# EAGLE schematic kwpa_ldmos2 (EAGLE 7.7.0)

## Sheet 1 of 2: Input
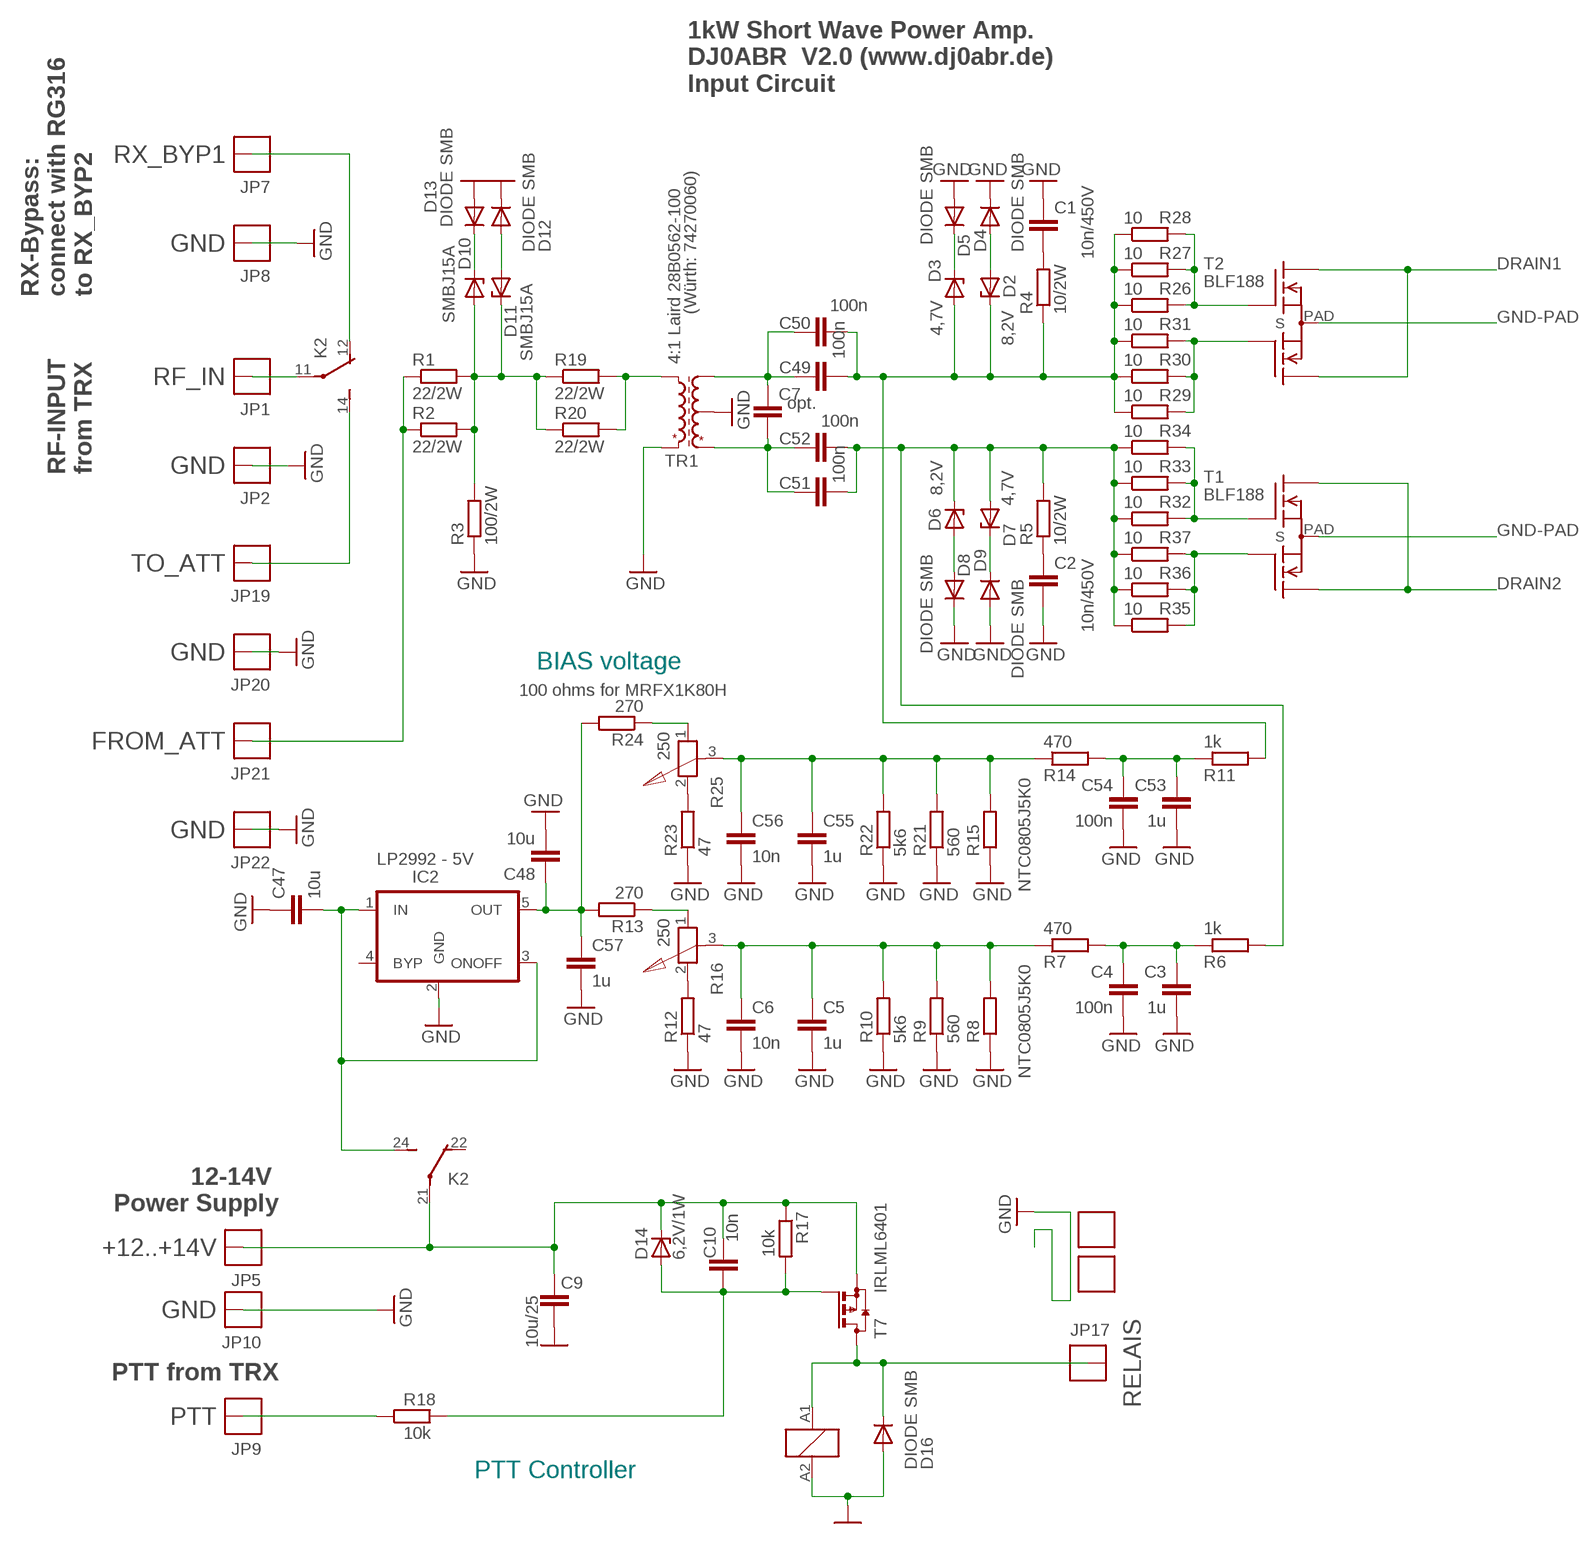
[diagram p0: schematic, sheet 1]

### Parts
C1  10n/450V  C-EUC1206K  [C1206K]
C2  10n/450V  C-EUC1206K  [C1206K]
C3  1u  C-EUC0603K  [C0603K]
C4  100n  C-EUC0603K  [C0603K]
C5  1u  C-EUC0603K  [C0603K]
C6  10n  C-EUC0603K  [C0603K]
C7  opt.  C-EUC1206K  [C1206K]
C9  10u/25  C-EUC0805K  [C0805K]
C10  10n  C-EUC0603K  [C0603K]
C47  10u  C-EUC0805K  [C0805K]
C48  10u  C-EUC0603K  [C0603K]
C49  100n  C-EUC1812K  [C1812K]
C50  100n  C-EUC1812K  [C1812K]
C51  100n  C-EUC1812K  [C1812K]
C52  100n  C-EUC1812K  [C1812K]
C53  1u  C-EUC0603K  [C0603K]
C54  100n  C-EUC0603K  [C0603K]
C55  1u  C-EUC0603K  [C0603K]
C56  10n  C-EUC0603K  [C0603K]
C57  1u  C-EUC0603K  [C0603K]
D2  8,2V  ZPYSMA  [SMA]
D3  4,7V  ZPYSMA  [SMA]
D4  DIODE SMB  DIODE-SMB  [SMB]
D5  DIODE SMB  DIODE-SMB  [SMB]
D6  8,2V  ZPYSMA  [SMA]
D7  4,7V  ZPYSMA  [SMA]
D8  DIODE SMB  DIODE-SMB  [SMB]
D9  DIODE SMB  DIODE-SMB  [SMB]
D10  SMBJ15A  ZPYSMA  [SMA]
D11  SMBJ15A  ZPYSMA  [SMA]
D12  DIODE SMB  DIODE-SMB  [SMB]
D13  DIODE SMB  DIODE-SMB  [SMB]
D14  6,2V/1W  ZPYSMA  [SMA]
D16  DIODE SMB  DIODE-SMB  [SMB]
FID1  FIDUCIAL  [FIDUCIAL]
FID2  FIDUCIAL  [FIDUCIAL]
H1  HOLE_32  [HOLE32]
H2  HOLE_32  [HOLE32]
H3  HOLE_32  [HOLE32]
H4  HOLE_32  [HOLE32]
H5  HOLE_32  [HOLE32]
H6  HOLE_32  [HOLE32]
H7  HOLE_32  [HOLE32]
H8  HOLE_32  [HOLE32]
H9  HOLE_32  [HOLE32]
H10  HOLE_32  [HOLE32]
H11  HOLE_32  [HOLE32]
H12  HOLE_32  [HOLE32]
H13  HOLE_32  [HOLE32]
H14  HOLE_32  [HOLE32]
IC2  LP2992 - 5V  UREG5  [SOT23-5]
JP1  RF_IN  THICKPINSQUARE  [THICKPIN]
JP2  GND  THICKPINSQUARE  [THICKPIN]
JP5  +12..+14V  THICKPINSQUARE  [THICKPIN]
JP7  RX_BYP1  THICKPINSQUARE  [THICKPIN]
JP8  GND  THICKPINSQUARE  [THICKPIN]
JP9  PTT  THICKPINSQUARE  [THICKPIN]
JP10  GND  THICKPINSQUARE  [THICKPIN]
JP17  RELAIS  THICKPINSQUARE  [THICKPIN]
JP19  TO_ATT  THICKPINSQUARE  [THICKPIN]
JP20  GND  THICKPINSQUARE  [THICKPIN]
JP21  FROM_ATT  THICKPINSQUARE  [THICKPIN]
JP22  GND  THICKPINSQUARE  [THICKPIN]
K2  FINDER-30.22  [FINDER-30.22]
R1  22/2W  R-EU_R2512  [R2512]
R2  22/2W  R-EU_R2512  [R2512]
R3  100/2W  R-EU_R2512  [R2512]
R4  10/2W  R-EU_R2512  [R2512]
R5  10/2W  R-EU_R2512  [R2512]
R6  1k  R-EU_R0603  [R0603]
R7  470  R-EU_R0603  [R0603]
R8  NTC0805J5K0  R-EU_R0805  [R0805]
R9  560  R-EU_R0603  [R0603]
R10  5k6  R-EU_R0603  [R0603]
R11  1k  R-EU_R0603  [R0603]
R12  47  R-EU_R0603  [R0603]
R13  270  R-EU_R0603  [R0603]
R14  470  R-EU_R0603  [R0603]
R15  NTC0805J5K0  R-EU_R0805  [R0805]
R16  250  MINIPOTI-S  [MINIPOTI]
R17  10k  R-EU_R0603  [R0603]
R18  10k  R-EU_R0603  [R0603]
R19  22/2W  R-EU_R2512  [R2512]
R20  22/2W  R-EU_R2512  [R2512]
R21  560  R-EU_R0603  [R0603]
R22  5k6  R-EU_R0603  [R0603]
R23  47  R-EU_R0603  [R0603]
R24  270  R-EU_R0603  [R0603]
R25  250  MINIPOTI-S  [MINIPOTI]
R26  10  R-EU_R1206  [R1206]
R27  10  R-EU_R1206  [R1206]
R28  10  R-EU_R1206  [R1206]
R29  10  R-EU_R1206  [R1206]
R30  10  R-EU_R1206  [R1206]
R31  10  R-EU_R1206  [R1206]
R32  10  R-EU_R1206  [R1206]
R33  10  R-EU_R1206  [R1206]
R34  10  R-EU_R1206  [R1206]
R35  10  R-EU_R1206  [R1206]
R36  10  R-EU_R1206  [R1206]
R37  10  R-EU_R1206  [R1206]
T1  BLF188  [BLF188]
T2  BLF188  [BLF188]
T7  IRLML6401  BSS84  [SOT23]
TR1  4:1 Laird 28B0562-100  TRAFO_1W_2W_MIT_ANZAPFUNGKWPAINPUT  [KW-INPUT_LAIRD_28B0562-100]

### Nets
ATTM: D10.A D11.C R1.2 R2.2 R3.2 R19.1 R20.1
BYP1: JP7.1 K2.12(-1:O)
DD1: C49.2 C50.2 D2.C D3.A R4.1 R11.2 R26.1 R27.1 R28.1 R29.1 R30.1 R31.1
DD2: C51.2 C52.2 D6.C D7.A R5.2 R6.2 R32.1 R33.1 R34.1 R35.1 R36.1 R37.1
DI1: C7.1 C49.1 C50.1 TR1.OUT2(S2)
DI2: C7.2 C51.1 C52.1 TR1.OUT1(S1)
DRAIN1: T2.1(D1) T2.2(D2) ; also sheet 2
DRAIN2: T1.1(D1) T1.2(D2) ; also sheet 2
G1: R26.2 R27.2 R28.2 T2.3(G1)
G2: R29.2 R30.2 R31.2 T2.4(G2)
G3: R32.2 R33.2 R34.2 T1.3(G1)
G4: R35.2 R36.2 R37.2 T1.4(G2)
GND: C1.1 C2.2 C3.2 C4.2 C5.2 C6.2 C9.2 C47.1 C48.2 C53.2 C54.2 C55.2 C56.2 C57.2 D4.C D5.A D8.C D9.A D12.C D13.A D16.A H1.P$1 H2.P$1 H3.P$1 H4.P$1 H5.P$1 H6.P$1 H7.P$1 H8.P$1 H9.P$1 H10.P$1 H11.P$1 H12.P$1 H13.P$1 H14.P$1 IC2.2(GND) JP2.1 JP8.1 JP10.1 JP20.1 JP22.1 K2.A2 R3.1 R8.1 R9.1 R10.1 R12.1 R15.1 R21.1 R22.1 R23.1 TR1.COM(SM) TR1.GND(P1) ; supply symbol labelled  ; also sheet 2
N$1: JP21.1 R1.1 R2.1
N$2: C47.2 IC2.1(IN) IC2.3(ONOFF) K2.24(-2:S)
N$3: D10.C D13.C
N$5: C1.2 R4.2
N$6: C2.1 R5.1
N$7: JP19.1 K2.14(-1:S)
N$8: C3.1 C4.1 R6.1 R7.2
N$9: C5.1 C6.1 R7.1 R8.2 R9.2 R10.2 R16.3
N$10: T1.PAD(S)
N$12: R12.2 R16.2
N$13: R13.1 R16.1
N$14: C48.1 C57.1 IC2.5(OUT) R13.2 R24.2
N$15: D3.C D5.C
N$16: D2.A D4.A
N$17: C53.1 C54.1 R11.1 R14.2
N$18: D7.C D9.C
N$19: D6.A D8.A
N$20: D11.A D12.A
N$21: C55.1 C56.1 R14.1 R15.2 R21.2 R22.2 R25.3
N$22: R23.2 R25.2
N$23: R24.1 R25.1
N$26: T2.PAD(S)
N$28: C10.2 D14.A R17.2 R18.2 T7.1(G)
N$33: JP9.1 R18.1
N$34: R19.2 R20.2 TR1.IN(P2)
RELAISOUT: D16.C JP17.1 K2.A1 T7.3(D)
RFIN: JP1.1 K2.11(-1:P)
U12: C9.1 C10.1 D14.C JP5.1 K2.21(-2:P) R17.1 T7.2(S)
Unconnected: FID1.P$1 FID2.P$1 K2.22(-2:O)

### Notes on the sheet
- 1kW Short Wave Power Amp.
  DJ0ABR  V2.0 (www.dj0abr.de)
  Input Circuit
- RX-Bypass:
  connect with RG316
  to RX_BYP2
- (Würth: 74270060)
- GND-PAD
- RF-INPUT
  from TRX
- GND-PAD
- BIAS voltage
- 100 ohms for MRFX1K80H
- 12-14V 
  Power Supply
- PTT from TRX
- PTT Controller

## Sheet 2 of 2: Output
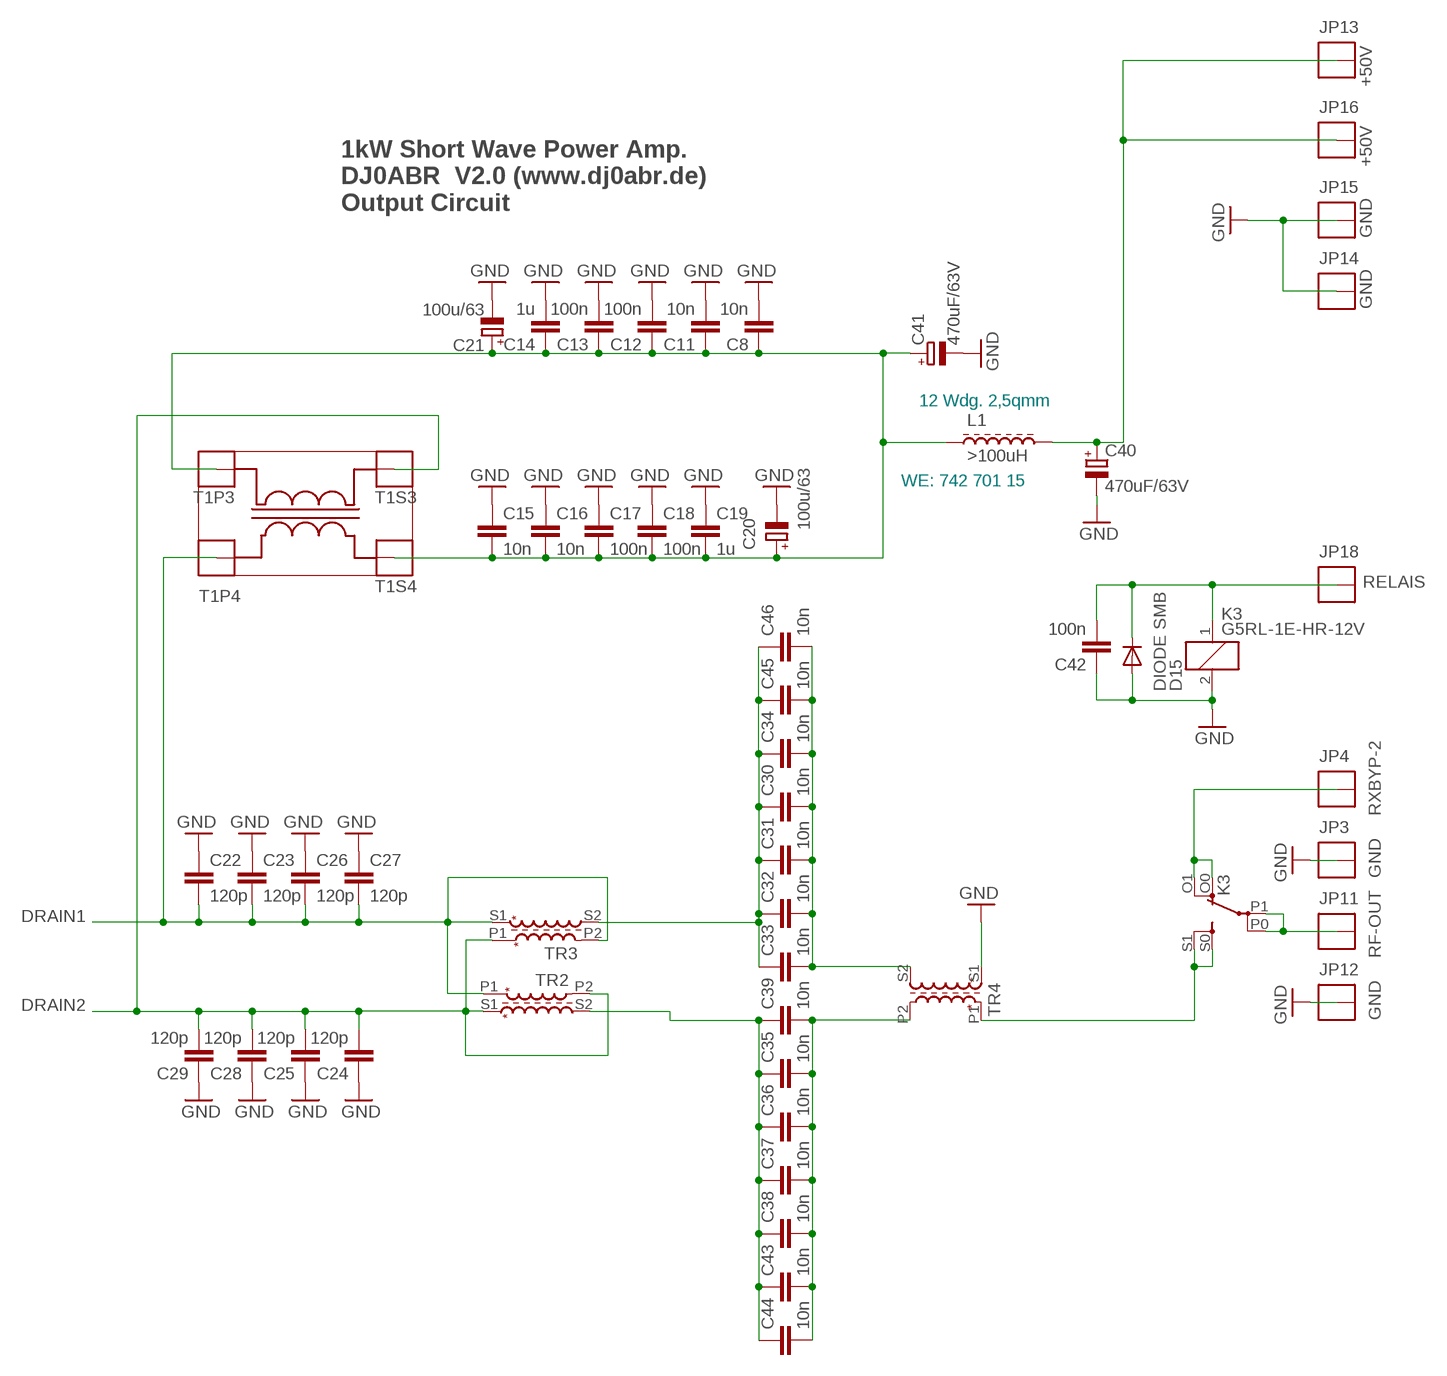
[diagram p1: schematic, sheet 2]

### Parts
C8  10n  C-EUC1812K  [C1812K]
C11  10n  C-EUC1812K  [C1812K]
C12  100n  C-EUC1812K  [C1812K]
C13  100n  C-EUC1812K  [C1812K]
C14  1u  C-EUC1812K  [C1812K]
C15  10n  C-EUC1812K  [C1812K]
C16  10n  C-EUC1812K  [C1812K]
C17  100n  C-EUC1812K  [C1812K]
C18  100n  C-EUC1812K  [C1812K]
C19  1u  C-EUC1812K  [C1812K]
C20  100u/63  CPOL-EU153CLV-1014  [153CLV-1014]
C21  100u/63  CPOL-EU153CLV-1014  [153CLV-1014]
C22  120p  C-EUC1812K  [C1812K]
C23  120p  C-EUC1812K  [C1812K]
C24  120p  C-EUC1812K  [C1812K]
C25  120p  C-EUC1812K  [C1812K]
C26  120p  C-EUC1812K  [C1812K]
C27  120p  C-EUC1812K  [C1812K]
C28  120p  C-EUC1812K  [C1812K]
C29  120p  C-EUC1812K  [C1812K]
C30  10n  C-EUC1210K  [C1210K]
C31  10n  C-EUC1210K  [C1210K]
C32  10n  C-EUC1210K  [C1210K]
C33  10n  C-EUC1210K  [C1210K]
C34  10n  C-EUC1210K  [C1210K]
C35  10n  C-EUC1210K  [C1210K]
C36  10n  C-EUC1210K  [C1210K]
C37  10n  C-EUC1210K  [C1210K]
C38  10n  C-EUC1210K  [C1210K]
C39  10n  C-EUC1210K  [C1210K]
C40  470uF/63V  CPOL-EUE5-13  [E5-13]
C41  470uF/63V  CPOL-EUE5-13  [E5-13]
C42  100n  C-EUC0603K  [C0603K]
C43  10n  C-EUC1210K  [C1210K]
C44  10n  C-EUC1210K  [C1210K]
C45  10n  C-EUC1210K  [C1210K]
C46  10n  C-EUC1210K  [C1210K]
D15  DIODE SMB  DIODE-SMB  [SMB]
JP3  GND  THICKPINSQUARE  [THICKPIN]
JP4  RXBYP-2  THICKPINSQUARE  [THICKPIN]
JP11  RF-OUT  THICKPINSQUARE  [THICKPIN]
JP12  GND  THICKPINSQUARE  [THICKPIN]
JP13  +50V  THICKPINSQUARE  [THICKPIN]
JP14  GND  THICKPINSQUARE  [THICKPIN]
JP15  GND  THICKPINSQUARE  [THICKPIN]
JP16  +50V  THICKPINSQUARE  [THICKPIN]
JP18  RELAIS  THICKPINSQUARE  [THICKPIN]
K3  G5RL-1E-HR-12V  G2RE  [G2RE]
L1  >100uH  SPULE_1W30X12  [KERN90_STEHEND_2PIN]
T1P3  THICKPINSMD2,5X4  [SMDPAD2,5X4]
T1P4  THICKPINSMD2,5X4  [SMDPAD2,5X4]
T1S3  THICKPINSMD2,5X4  [SMDPAD2,5X4]
T1S4  THICKPINSMD2,5X4  [SMDPAD2,5X4]
TR2  TRAFO_1W_1W_GERADE_DOPPELROHR  [DOPPELRINGKERN]
TR3  TRAFO_1W_1W_GERADE_DOPPELROHRREVERSE  [DOPPELRINGKERN_REV]
TR4  TRAFO_1W_1WMANTEL_STEHEND  [DOPPELLMANTEL_STEHEND]

### Nets
DRAIN1: C22.2 C23.2 C26.2 C27.2 T1P4.P$1 TR2.P1 TR3.P2 TR3.S1 ; also sheet 1
DRAIN2: C24.2 C25.2 C28.2 C29.2 T1S3.P$1 TR2.P2 TR2.S1 TR3.P1 ; also sheet 1
GND: C8.2 C11.2 C12.2 C13.2 C14.2 C15.1 C16.1 C17.1 C18.1 C19.1 C20.- C21.- C22.1 C23.1 C24.1 C25.1 C26.1 C27.1 C28.1 C29.1 C40.- C41.- C42.1 D15.A JP3.1 JP12.1 JP14.1 JP15.1 K3.2 TR4.S1 ; also sheet 1
N$4: JP11.1 K3.P0(2:P) K3.P1(2:P)
N$29: JP4.1 K3.O0(2:O) K3.O1(2:O)
OUTP1: C30.1 C31.1 C32.1 C33.1 C34.1 C45.1 C46.1 TR3.S2
OUTP2: C35.1 C36.1 C37.1 C38.1 C39.1 C43.1 C44.1 TR2.S2
OUTR1: K3.S0(2:S) K3.S1(2:S) TR4.P1
OUTS1: C30.2 C31.2 C32.2 C33.2 C34.2 C45.2 C46.2 TR4.S2
OUTS2: C35.2 C36.2 C37.2 C38.2 C39.2 C43.2 C44.2 TR4.P2
RELAIS: C42.2 D15.C JP18.1 K3.1
UIN: C40.+ JP13.1 JP16.1 L1.P$1
UVERS: C8.1 C11.1 C12.1 C13.1 C14.1 C15.2 C16.2 C17.2 C18.2 C19.2 C20.+ C21.+ C41.+ L1.P$2 T1P3.P$1 T1S4.P$1

### Notes on the sheet
- 1kW Short Wave Power Amp.
  DJ0ABR  V2.0 (www.dj0abr.de)
  Output Circuit
- 12 Wdg. 2,5qmm
- WE: 742 701 15

## Power pins joined to a net without a drawn wire
BYP: IC2.4(BYP)

## Library data of the parts
C1-C19 C22-C39 C42-C57 = rcl:C-EU: CAPACITOR, European symbol
C20 C21 C40 C41 = rcl:CPOL-EU: POLARIZED CAPACITOR, European symbol
D2 D3 D6 D7 D10 D11 D14 = km:ZPY: Z DIODE 1 W
D4 D5 D8 D9 D12 D13 D15 D16 = diode:DIODE-: DIODE
FID1 FID2 = km:FIDUCIAL
H1-H14 = km:HOLE_32
IC2 = km:UREG5
JP1-JP5 JP7-JP22 T1P3 T1P4 T1S3 T1S4 = km:THICKPIN
K2 = relay:FINDER-30.22: SUBMINIATURE DIL-RELAIS FINDER 30.22.9.024.0000 Kontakt max. AC - 125V Distributor: Farnell Bestell Nr.: 1217371 Source: http://www.farnell.com/datasheets/87634.pdf; OC_FARNELL: unknown; OC_NEWARK: unknown
K3 = relay:G2RE: RELAY 1 x switch, high current, Omron; OC_FARNELL: unknown; OC_NEWARK: unknown
L1 = km_HF:SPULE_1W
R1-R15 R17-R24 R26-R37 = rcl:R-EU_: RESISTOR, European symbol
R16 R25 = km:MINIPOTI-S
T1 T2 = km_HF:BLF188
T7 = transistor-small-signal:BSS84: P-CHANNEL MOS FET
TR1 = km_HF:TRAFO_1W_2W_MIT_ANZAPFUNG
TR2 TR3 = km_HF:TRAFO_1W_1W_GERADE_DOPPELROHR
TR4 = km_HF:TRAFO_1W_1W